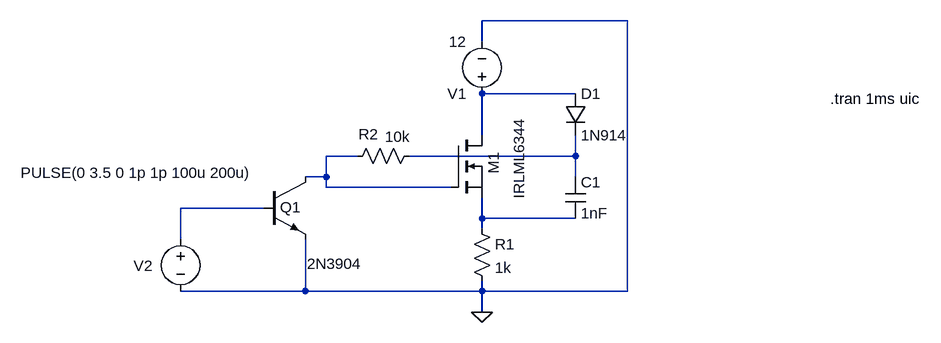
[diagram p0: schematic bootstrap exmaple.asc]
bootstrap exmaple.asc, the LTspice schematic file:
Version 4.1
SHEET 1 920 680
WIRE 208 -224 -16 -224
WIRE -16 -192 -16 -224
WIRE 128 -112 -16 -112
WIRE -16 -48 -16 -112
WIRE -208 -16 -256 -16
WIRE 128 -16 128 -48
WIRE 128 -16 -128 -16
WIRE -256 16 -256 -16
WIRE -256 16 -288 16
WIRE 128 16 128 -16
WIRE -256 32 -256 16
WIRE -64 32 -256 32
WIRE -352 64 -480 64
WIRE -16 80 -16 48
WIRE 128 80 -16 80
WIRE -16 96 -16 80
WIRE -480 112 -480 64
WIRE -288 192 -288 112
WIRE -288 192 -480 192
WIRE -16 192 -16 176
WIRE -16 192 -288 192
WIRE 208 192 208 -224
WIRE 208 192 -16 192
WIRE -16 224 -16 192
FLAG -16 224 0
SYMBOL voltage -16 -96 R180
WINDOW 123 0 0 Left 0
WINDOW 39 0 0 Left 0
SYMATTR InstName V1
SYMATTR Value 12
SYMBOL res -32 80 R0
SYMATTR InstName R1
SYMATTR Value 1k
SYMBOL nmos -64 -48 R0
WINDOW 0 66 26 VRight 2
WINDOW 3 105 -27 VRight 2
SYMATTR InstName M1
SYMATTR Value IRLML6344
SYMBOL voltage -480 96 R0
WINDOW 0 -72 57 Left 2
WINDOW 3 -246 -86 Left 2
WINDOW 123 0 0 Left 0
WINDOW 39 0 0 Left 0
SYMATTR InstName V2
SYMATTR Value PULSE(0 3.5 0 1p 1p 100u 200u)
SYMBOL diode 112 -112 R0
SYMATTR InstName D1
SYMATTR Value 1N914
SYMBOL cap 112 16 R0
SYMATTR InstName C1
SYMATTR Value 1nF
SYMBOL npn -352 16 R0
WINDOW 0 25 47 Left 2
WINDOW 3 67 134 Left 2
SYMATTR InstName Q1
SYMATTR Value 2N3904
SYMBOL res -112 -32 R90
WINDOW 0 -2 79 VBottom 2
WINDOW 3 -29 34 VTop 2
SYMATTR InstName R2
SYMATTR Value 10k
TEXT 520 -104 Left 2 !.tran 1ms uic

The netlist it stands for:
* bootstrap exmaple.asc
V1 N001 0 12
R1 N005 0 1k
M1 N001 N002 N005 N005 IRLML6344
V2 N004 0 PULSE(0 3.5 0 1p 1p 100u 200u)
D1 N001 N003 1N914
C1 N003 N005 1nF
Q1 N002 N004 0 0 2N3904
R2 N003 N002 10k
.model D D
.lib standard.dio
.model NPN NPN
.model PNP PNP
.lib standard.bjt
.model NMOS NMOS
.model PMOS PMOS
.lib standard.mos
.tran 1ms uic
.backanno
.end